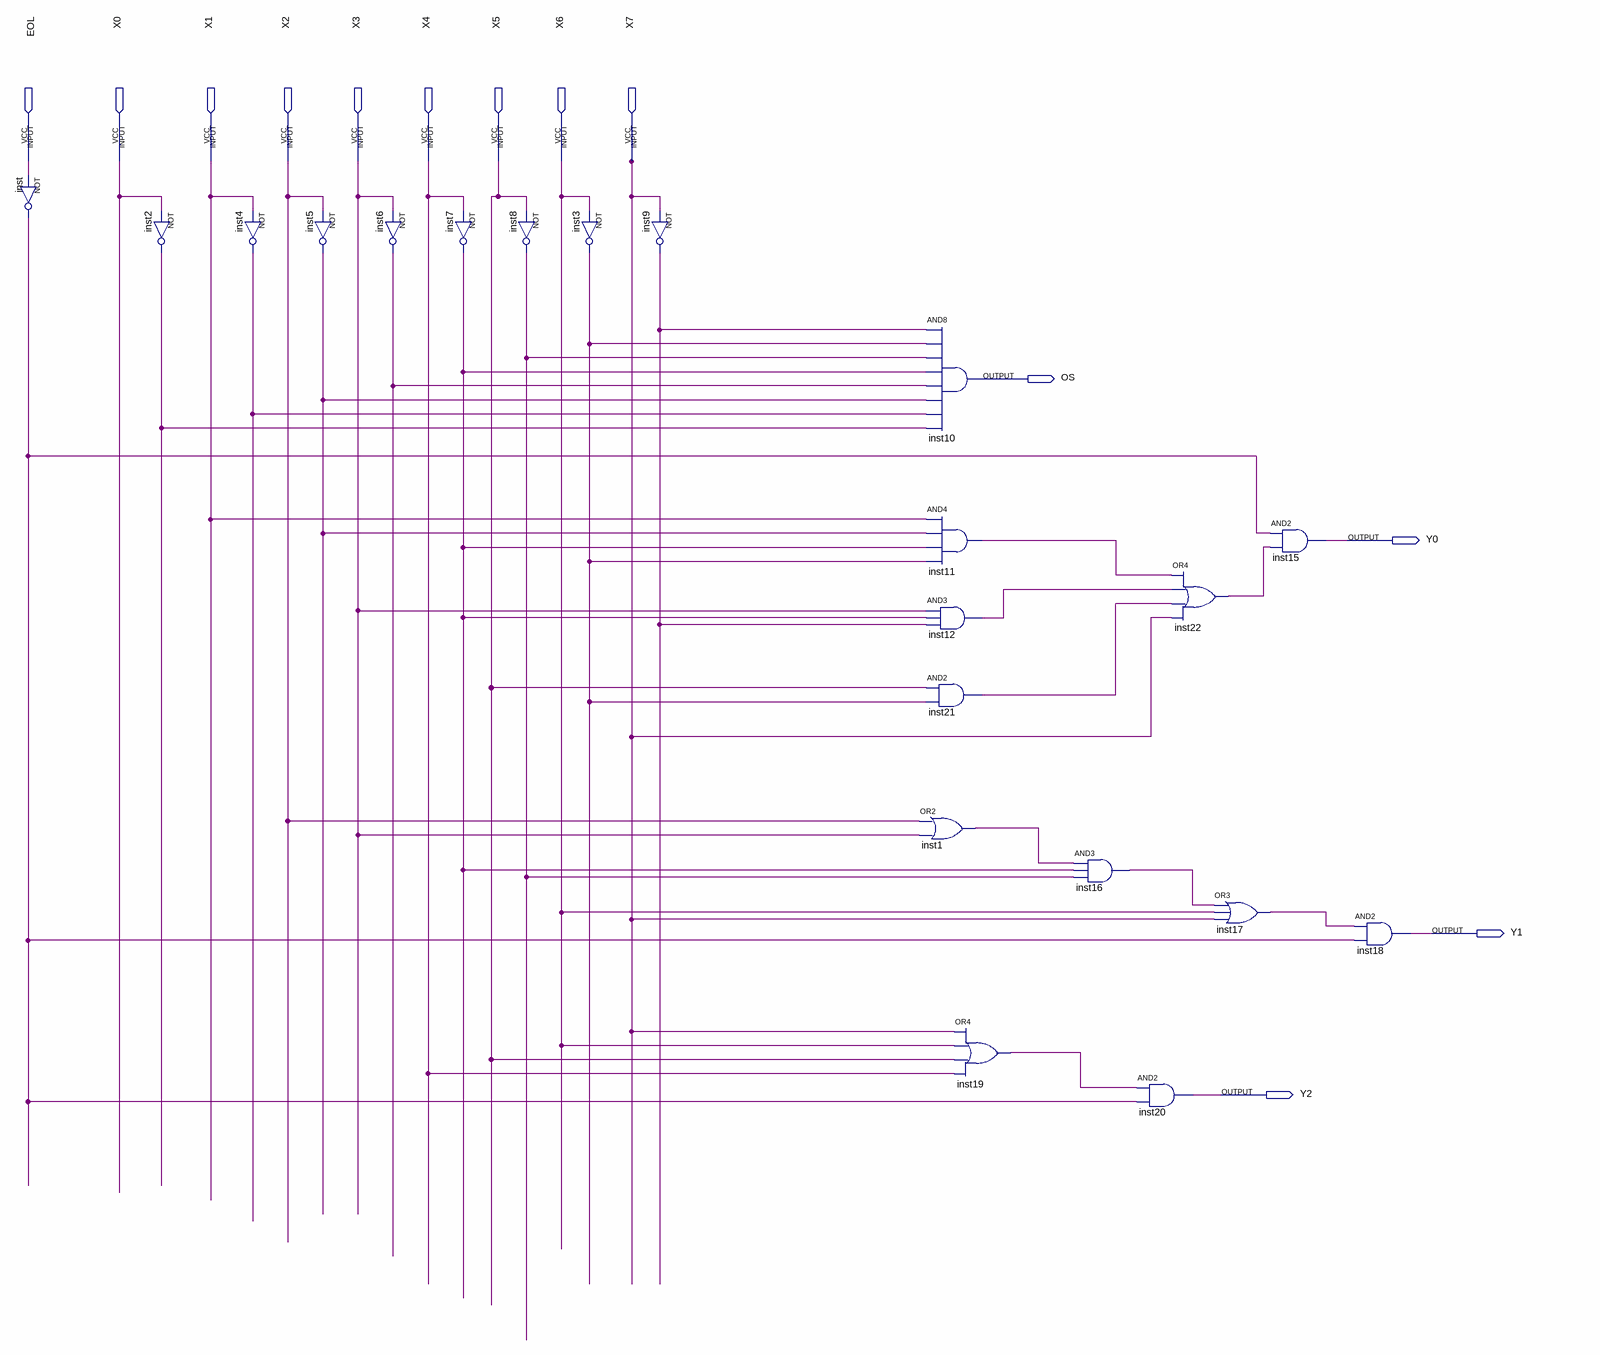
[diagram p0: schematic sheet]
// Quartus schematic PEnc8_3.bdf as structural Verilog: 21 symbols, 13 pins
module PEnc8_3 (
  input  EOL,
  input  X0,
  input  X1,
  input  X2,
  input  X3,
  input  X4,
  input  X5,
  input  X6,
  input  X7,
  output OS,
  output Y0,
  output Y1,
  output Y2
);

  wire inst1_out, inst2_out, inst3_out, inst4_out, inst5_out, inst6_out, inst7_out, inst8_out, inst9_out,
       inst11_out, inst12_out, inst16_out, inst17_out, inst19_out, inst21_out, inst22_out, inst_out;

  not inst (inst_out, EOL);
  not inst2 (inst2_out, X0);
  not inst4 (inst4_out, X1);
  not inst5 (inst5_out, X2);
  not inst6 (inst6_out, X3);
  not inst7 (inst7_out, X4);
  not inst8 (inst8_out, X5);
  not inst3 (inst3_out, X6);
  not inst9 (inst9_out, X7);
  and inst10 (OS, inst9_out, inst3_out, inst8_out, inst7_out, inst6_out, inst5_out, inst4_out, inst2_out);
  and inst11 (inst11_out, X1, inst5_out, inst7_out, inst3_out);
  and inst12 (inst12_out, X3, inst7_out, inst9_out);
  and inst21 (inst21_out, X5, inst3_out);
  or inst1 (inst1_out, X2, X3);
  or inst19 (inst19_out, X7, X6, X5, X4);
  and inst16 (inst16_out, inst1_out, inst7_out, inst8_out);
  and inst20 (Y2, inst19_out, inst_out);
  or inst22 (inst22_out, inst11_out, inst12_out, inst21_out, X7);
  or inst17 (inst17_out, inst16_out, X6, X7);
  and inst15 (Y0, inst_out, inst22_out);
  and inst18 (Y1, inst17_out, inst_out);
endmodule
